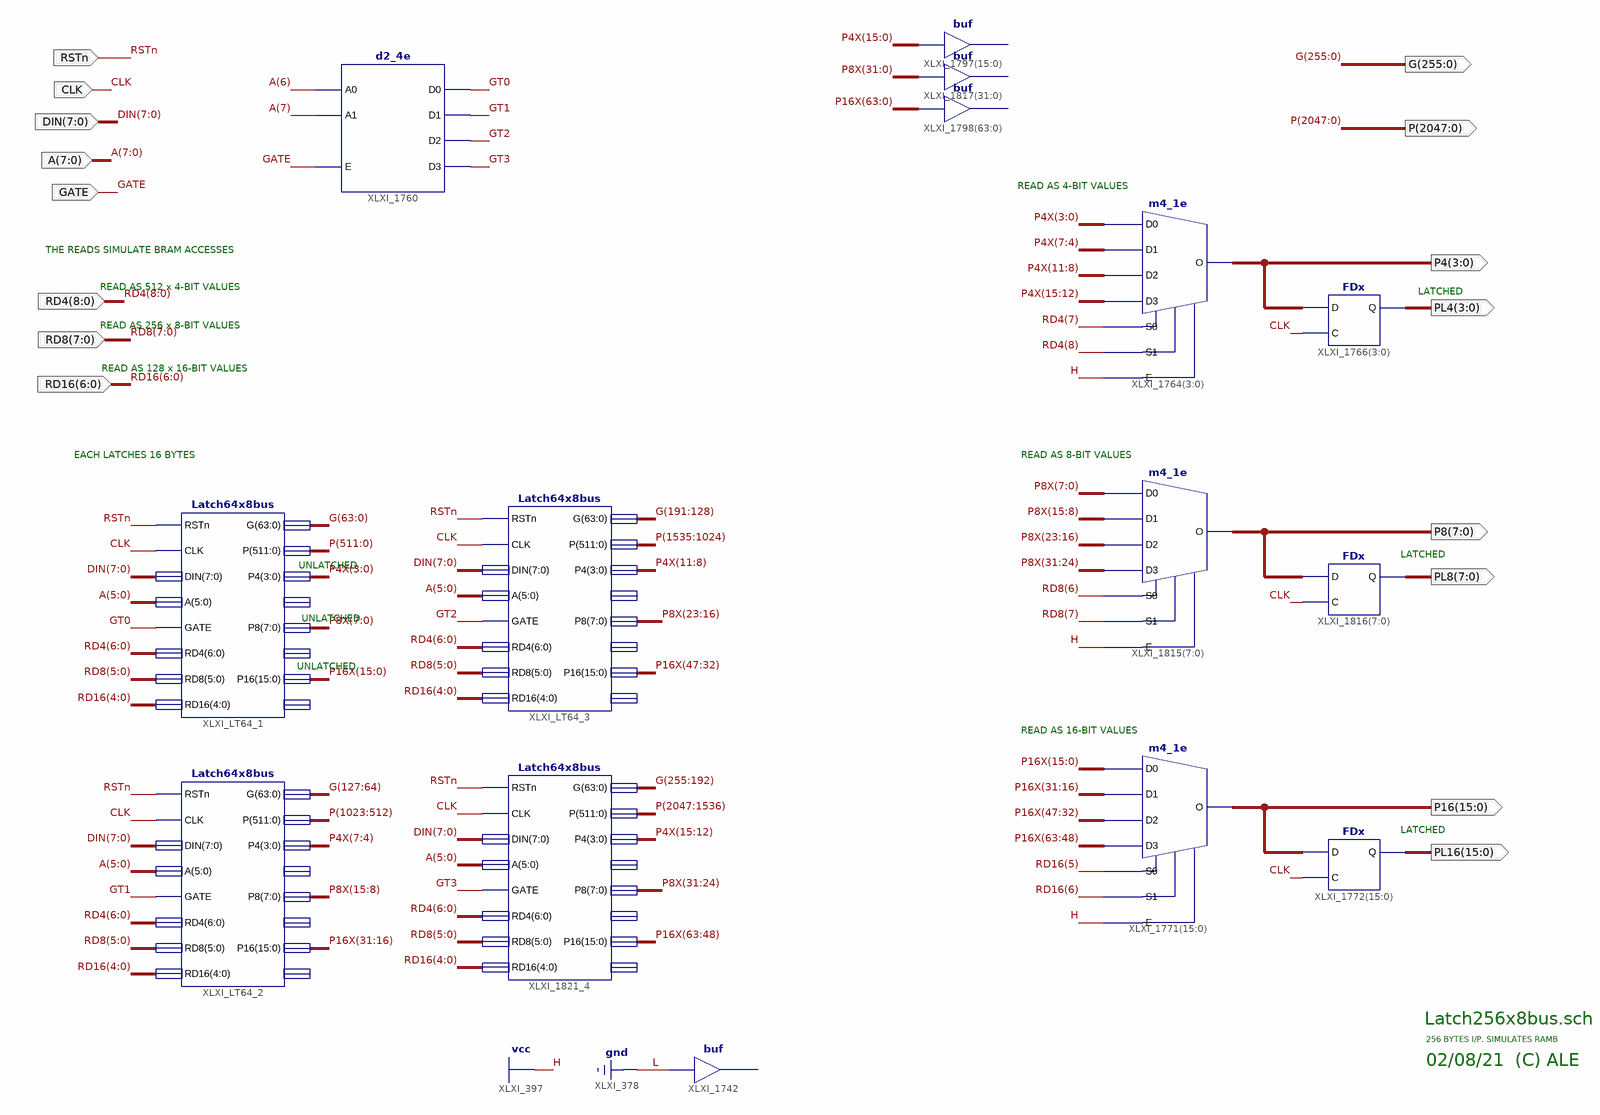
[diagram p0: schematic sheet 1]
// Xilinx ISE schematic Latch256x8bus.sch (spartan3e) as structural Verilog: 15 symbols, 21 ports
module Latch256x8bus (
  input  RSTn,
  input  [7:0] DIN,
  input  CLK,
  input  [7:0] A,
  input  GATE,
  input  [8:0] RD4,
  input  [7:0] RD8,
  input  [6:0] RD16,
  output [2047:0] P,
  output [3:0] P4,
  output [255:0] G,
  output [3:0] PL4,
  output [15:0] P16,
  output [15:0] PL16,
  output [7:0] P8,
  output [7:0] PL8
);

  wire GT0, GT1, GT2, GT3;
  wire [15:0] P4X;
  wire [31:0] P8X;
  wire [63:0] P16X;

  // buf XLXI_1742 has open pins: I=1'b0, O=open
  d2_4e XLXI_1760 (.A0(A[6]), .A1(A[7]), .E(GATE), .D0(GT0), .D1(GT1), .D2(GT2), .D3(GT3));
  // buf XLXI_1798[63..0] has open pins: I=P16X, O=open
  m4_1e XLXI_1764[3:0] (
    .D0(P4X[3:0]), .D1(P4X[7:4]), .D2(P4X[11:8]), .D3(P4X[15:12]), .E(1'b1), .S0(RD4[7]), .S1(RD4[8]), .O(P4));
  FDx XLXI_1766[3:0] (.C(CLK), .D(P4), .Q(PL4));
  m4_1e XLXI_1771[15:0] (
    .D0(P16X[15:0]), .D1(P16X[31:16]), .D2(P16X[47:32]), .D3(P16X[63:48]), .E(1'b1), .S0(RD16[5]),
    .S1(RD16[6]), .O(P16));
  FDx XLXI_1772[15:0] (.C(CLK), .D(P16), .Q(PL16));
  m4_1e XLXI_1815[7:0] (
    .D0(P8X[7:0]), .D1(P8X[15:8]), .D2(P8X[23:16]), .D3(P8X[31:24]), .E(1'b1), .S0(RD8[6]), .S1(RD8[7]),
    .O(P8));
  FDx XLXI_1816[7:0] (.C(CLK), .D(P8), .Q(PL8));
  // buf XLXI_1797[15..0] has open pins: I=P4X, O=open
  // buf XLXI_1817[31..0] has open pins: I=P8X, O=open
  Latch64x8bus XLXI_LT64_1 (
    .A(A[5:0]), .CLK(CLK), .DIN(DIN), .G(G[63:0]), .GATE(GT0), .P(P[511:0]), .P16(P16X[15:0]), .P4(P4X[3:0]),
    .P8(P8X[7:0]), .RD16(RD16[4:0]), .RD4(RD4[6:0]), .RD8(RD8[5:0]), .RSTn(RSTn));  // open: PL16, PL4, PL8
  Latch64x8bus XLXI_LT64_2 (
    .A(A[5:0]), .CLK(CLK), .DIN(DIN), .G(G[127:64]), .GATE(GT1), .P(P[1023:512]), .P16(P16X[31:16]),
    .P4(P4X[7:4]), .P8(P8X[15:8]), .RD16(RD16[4:0]), .RD4(RD4[6:0]), .RD8(RD8[5:0]), .RSTn(RSTn));  // open: PL16, PL4, PL8
  Latch64x8bus XLXI_LT64_3 (
    .A(A[5:0]), .CLK(CLK), .DIN(DIN), .G(G[191:128]), .GATE(GT2), .P(P[1535:1024]), .P16(P16X[47:32]),
    .P4(P4X[11:8]), .P8(P8X[23:16]), .RD16(RD16[4:0]), .RD4(RD4[6:0]), .RD8(RD8[5:0]), .RSTn(RSTn));  // open: PL16, PL4, PL8
  Latch64x8bus XLXI_1821_4 (
    .A(A[5:0]), .CLK(CLK), .DIN(DIN), .G(G[255:192]), .GATE(GT3), .P(P[2047:1536]), .P16(P16X[63:48]),
    .P4(P4X[15:12]), .P8(P8X[31:24]), .RD16(RD16[4:0]), .RD4(RD4[6:0]), .RD8(RD8[5:0]), .RSTn(RSTn));  // open: PL16, PL4, PL8

  // Notes on the sheet:
  //   READ AS 4-BIT VALUES
  //   THE READS SIMULATE BRAM ACCESSES
  //   READ AS 512 x 4-BIT VALUES
  //   LATCHED
  //   READ AS 256 x 8-BIT VALUES
  //   READ AS 128 x 16-BIT VALUES
  //   EACH LATCHES 16 BYTES
  //   READ AS 8-BIT VALUES
  //   LATCHED
  //   UNLATCHED
  //   UNLATCHED
  //   UNLATCHED
  //   READ AS 16-BIT VALUES
  //   LATCHED
  //   Latch256x8bus.sch
  //   256 BYTES I/P. SIMULATES RAMB
  //   02/08/21  (C) ALE
endmodule
